# Altium schematic sheet Atmega328p-AU.SchDoc
size A4; SheetNumber: 2; SheetTotal: 4
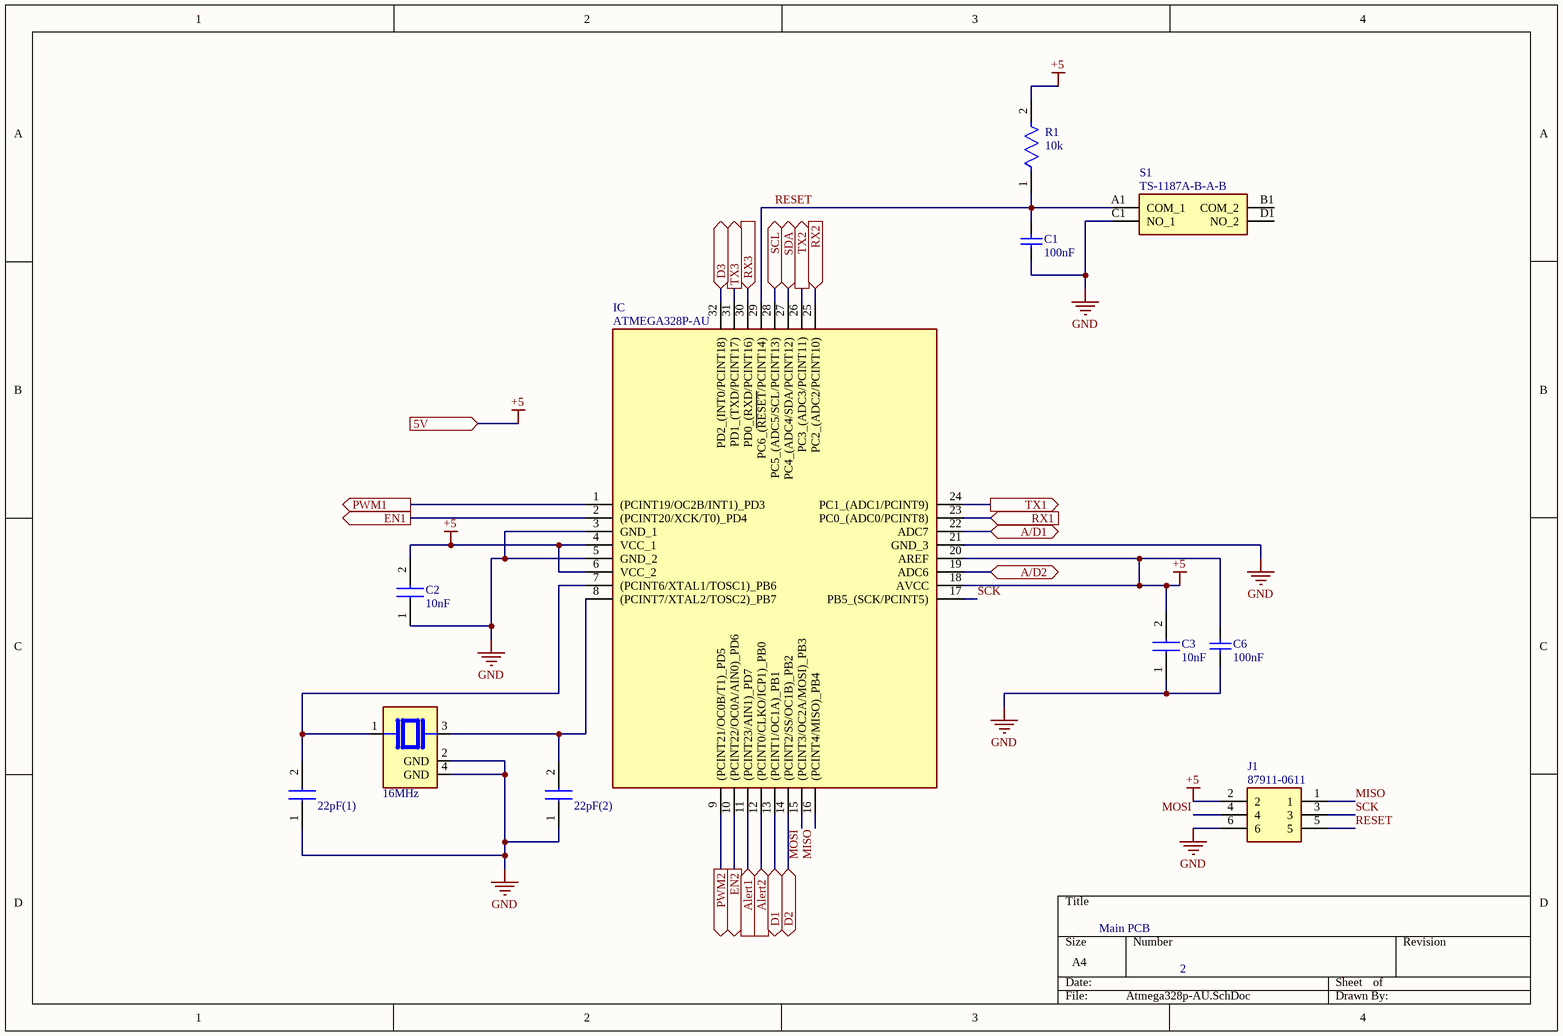
[diagram p0: Atmega328p-AU.SchDoc]

## Parts
16MHz  ABM11-16.000MHz-12-N1G-T  [XTAL_ABM11-16.000MHz-12-N1G-T]  (value not drawn)
22pF(1)  C1206C220JGGACTU  [C1206]  (value not drawn)
22pF(2)  C1206C220JGGACTU  [C1206]  (value not drawn)
C1  Capacitance: 100nF  [AVX-1206-2_L]  (hidden comment: 1206GC102KAT1A)
C2  10nF  [CAPC3216X94N]
C3  10nF  [CAPC3216X94N]
C6  Capacitance: 100nF  [AVX-1206-2_L]  (hidden comment: 1206GC102KAT1A)
IC  ATMEGA328P-AU  [QFP80P900X900X120-32N]
J1  87911-0611  [879110611]
R1  10k  [FP-RC1206-MFG]
S1  TS-1187A-B-A-B  [TS1187ABAB]

## Ports
5V (in, see Hierarchy[2B], Inputs_Outputs[2C], powerSupply[3B]), A/D1 (bidir, see Hierarchy[3B], Inputs_Outputs[3B]), A/D2 (bidir, see Hierarchy[3B], Inputs_Outputs[3B]), Alert1 (in, see Hierarchy[2B], Inputs_Outputs[2B]), Alert2 (in, see Hierarchy[2B], Inputs_Outputs[2B]), D1 (bidir, see Hierarchy[3A], Inputs_Outputs[3C]), D2 (bidir, see Hierarchy[3A], Inputs_Outputs[3C]), D3 (bidir, see Hierarchy[3A], Inputs_Outputs[3C]), EN1 (out, see Hierarchy[3B], Inputs_Outputs[3A]), EN2 (out, see Hierarchy[3B], Inputs_Outputs[3B]), PWM1 (out, see Hierarchy[3B], Inputs_Outputs[3A]), PWM2 (out, see Hierarchy[3B], Inputs_Outputs[3B]), RX1 (in, see Hierarchy[2B], Inputs_Outputs[2C]), RX2 (in, see Hierarchy[2B], Inputs_Outputs[2C]), RX3 (in, see Hierarchy[2B], Inputs_Outputs[2D]), SCL (bidir, see Hierarchy[2A], Inputs_Outputs[2B]), SDA (bidir, see Hierarchy[2A], Inputs_Outputs[2B]), TX1 (out, see Hierarchy[3B], Inputs_Outputs[2C]), TX2 (out, see Hierarchy[3B], Inputs_Outputs[2C]), TX3 (out, see Hierarchy[3B], Inputs_Outputs[2D])

## Nets
+5: C2.2 C3.2 C6.2 IC.4(VCC_1) IC.6(VCC_2) IC.18(AVCC) IC.20(AREF) J1.2 R1.2 ; port 5V
GND: 16MHz.2(GND) 16MHz.4(GND) 22pF(1).1 22pF(2).1 C1.1 C2.1 C3.1 C6.1 IC.3(GND_1) IC.5(GND_2) IC.21(GND_3) J1.6 S1.C1(NO_1)
A/D1: IC.22(ADC7) ; port A/D1
A/D2: IC.19(ADC6) ; port A/D2
Alert1: IC.11((PCINT23/AIN1)_PD7) ; port Alert1
Alert2: IC.12((PCINT0/CLKO/ICP1)_PB0) ; port Alert2
D1: IC.13((PCINT1/OC1A)_PB1) ; port D1
D2: IC.14((PCINT2/SS/OC1B)_PB2) ; port D2
D3: IC.32(PD2_(INT0/PCINT18)) ; port D3
EN1: IC.2((PCINT20/XCK/T0)_PD4) ; port EN1
EN2: IC.10((PCINT22/OC0A/AIN0)_PD6) ; port EN2
MISO: IC.16((PCINT4/MISO)_PB4) J1.1
MOSI: IC.15((PCINT3/OC2A/MOSI)_PB3) J1.4
PWM1: IC.1((PCINT19/OC2B/INT1)_PD3) ; port PWM1
PWM2: IC.9((PCINT21/OC0B/T1)_PD5) ; port PWM2
RESET: C1.2 IC.29(PC6_(~{RESET}/PCINT14)) J1.5 R1.1 S1.A1(COM_1)
RX1: IC.23(PC0_(ADC0/PCINT8)) ; port RX1
RX2: IC.25(PC2_(ADC2/PCINT10)) ; port RX2
RX3: IC.30(PD0_(RXD/PCINT16)) ; port RX3
SCK: IC.17(PB5_(SCK/PCINT5)) J1.3
SCL: IC.28(PC5_(ADC5/SCL/PCINT13)) ; port SCL
SDA: IC.27(PC4_(ADC4/SDA/PCINT12)) ; port SDA
TX1: IC.24(PC1_(ADC1/PCINT9)) ; port TX1
TX2: IC.26(PC3_(ADC3/PCINT11)) ; port TX2
TX3: IC.31(PD1_(TXD/PCINT17)) ; port TX3
Net16MHz_1: 16MHz.1 22pF(1).2 IC.7((PCINT6/XTAL1/TOSC1)_PB6)
Net16MHz_3: 16MHz.3 22pF(2).2 IC.8((PCINT7/XTAL2/TOSC2)_PB7)

Not connected (* = marked no-connect by the designer): S1 B1(COM_2) D1(NO_2)

## Notes on the sheet
- Main PCB
- 2

## Library data of the parts
16MHz = ABM11-16.000MHz-12-N1G-T: MF: {'manufacturer': u'Abracon LLC'}; Package: None; Price: None; Value: *; MP: ABM11-16.000MHz-12-N1G-T; Availability: Unavailable
22pF(1) 22pF(2) = C1206C220JGGACTU: Capacitor; Manufacturer_Name: KEMET; Datasheet Link: https://content.kemet.com/datasheets/KEM_C1009_C0G_HV_SMD.pdf; Manufacturer_Part_Number: C1206C220JGGACTU; Mouser Part Number: 80-C1206C220JGG; Mouser Price/Stock: https://www.mouser.co.uk/ProductDetail/KEMET/C1206C220JGGACTU?qs=bISZhnDGhxtrVzrFMq60vg%3D%3D
C1 C6 = CMP-2000-05468-1: Chip Capacitor, 1 nF, +/- 10%, -55 to 125 degC, 1206 (3216 Metric), RoHS, Tape and Reel; Manufacturer: AVX; Dielectric: X7R; Voltage Rating DC: 2000V; Package Reference: 1206; Datasheet Version: 11/2010; Mounting Technology: SurfaceMount; Manufacturer URL: http://www.avx.com/; Tolerance: 10%; Tolerance (%): ±10%; PartNumber: 1206GC102KAT1A; Datasheet URL: https://datasheet.ciiva.com/11787/0900766b80ed4c37-11787781.pdf; Package Description: 2-Pin SMD, Body 3.4 x 1.8 mm; Case Size/Dimension: 1206; Rated Voltage: 2000V
C2 C3 = KAM31BR81H103KT: Capacitor; Manufacturer_Name: Kyocera AVX; Datasheet Link: https://datasheets.kyocera-avx.com/AutoMLCCKAM.pdf; Height: 0.94mm; Manufacturer_Part_Number: KAM31BR81H103KT; Mouser Part Number: 581-KAM31BR81H103KT; Mouser Price/Stock: https://www.mouser.co.uk/ProductDetail/KYOCERA-AVX/KAM31BR81H103KT?qs=Jm2GQyTW%2FbjzijSUJGW%2FJA%3D%3D
IC = ATMEGA328P-AU: Integrated Circuit; Manufacturer_Name: Microchip; Datasheet Link: https://componentsearchengine.com/Datasheets/2/ATMEGA328P-AU.pdf; Height: 1.2mm; Manufacturer_Part_Number: ATMEGA328P-AU; Mouser Part Number: 556-ATMEGA328P-AU; Mouser Price/Stock: https://www.mouser.co.uk/ProductDetail/Microchip-Technology/ATMEGA328P-AU?qs=K8BHR703ZXiCmmgp6%2FGNmQ%3D%3D; Arrow Part Number: ATMEGA328P-AU; Arrow Price/Stock: https://www.arrow.com/en/products/atmega328p-au/microchip-technology?region=europe
J1 = 87911-0611: Connector; Manufacturer_Name: Molex; Datasheet Link: https://www.molex.com/content/dam/molex/molex-dot-com/products/automated/en-us/salesdrawingpdf/879/87911/879110611_sd.pdf; Height: 5.18mm; Manufacturer_Part_Number: 87911-0611; Mouser Part Number: 538-87911-0611; Mouser Price/Stock: https://www.mouser.co.uk/ProductDetail/Molex/87911-0611?qs=vTUKd8r8%252BfEYOBWrgoJ4qQ%3D%3D
R1 = CMP-2100-03681-2: RES SMD 0 OHM JUMPER 1/4W 1206; Manufacturer Part Number: RC1206JR-070RL; Manufacturer: YAGEO; Voltage Rating: 200V; Temperature Coefficient: 300ppm/°C; Power Rating: 0.25W; Value: 0Ω; Tolerance: 5%; Temperature Range Low: -55°C; Category: Res; Automotive: No; Ipc Land Pattern Name: RESC310160X55; Device Class L1: Passive Components; Temperature: -55°C to +155°C; ComponentLink2URL: https://www.yageo.com/upload/media/product/productsearch/datasheet/rchip/PYu-RC_Group_51_RoHS_L_10.pdf; Lead Free: Yes; Height: 0.65mm; Footprint Url: https://www.yageo.com/upload/website/yageo_PYu-R_Mount_10_19050818_343.pdf; Package: RC1206; Digikey Description: RES SMD 0 OHM JUMPER 1/4W 1206; Temperature Range High: +155°C; Device Class L3: Chip SMD Resistors; Device Class L2: Resistors; Octopart: https://octopart.com/rc1206jr-070rl-yageo-40025601; Resistance: 0Ω; Series: RC; ComponentLink2Description: Datasheet; Composition: Thick Film; RoHS: TRUE; Mouser Description: Resistor: thick film; SMD; 1206; 0O; 0.25W; ±5%; -55÷155°C
S1 = TS-1187A-B-A-B: Switch; Manufacturer_Name: XKB Connectivity; Datasheet Link: http://www.helloxkb.com/public/images/pdf/TS-1187A-X-X-X.pdf; Height: 4.05mm; Manufacturer_Part_Number: TS-1187A-B-A-B